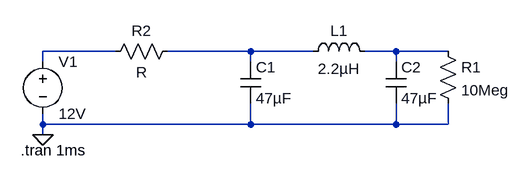
[diagram p0: schematic Draft1.asc]
Draft1.asc, the LTspice schematic file:
Version 4
SHEET 1 880 680
WIRE 0 128 -112 128
WIRE 208 128 80 128
WIRE 304 128 208 128
WIRE 432 128 384 128
WIRE 512 128 432 128
WIRE -112 144 -112 128
WIRE 208 144 208 128
WIRE 432 144 432 128
WIRE -112 240 -112 224
WIRE 208 240 208 208
WIRE 208 240 -112 240
WIRE 432 240 432 208
WIRE 432 240 208 240
WIRE 512 240 512 208
WIRE 512 240 432 240
WIRE -112 256 -112 240
FLAG -112 256 0
SYMBOL voltage -112 128 R0
WINDOW 123 0 0 Left 0
WINDOW 39 0 0 Left 0
SYMATTR InstName V1
SYMATTR Value 12V
SYMBOL cap 192 144 R0
SYMATTR InstName C1
SYMATTR Value 47µF
SYMBOL cap 416 144 R0
SYMATTR InstName C2
SYMATTR Value 47µF
SYMBOL ind 288 144 R270
WINDOW 0 32 56 VTop 2
WINDOW 3 5 56 VBottom 2
SYMATTR InstName L1
SYMATTR Value 2.2µH
SYMBOL res 496 112 R0
SYMATTR InstName R1
SYMATTR Value 10Meg
SYMBOL res 96 112 R90
WINDOW 0 0 56 VBottom 2
WINDOW 3 32 56 VTop 2
SYMATTR InstName R2
TEXT -146 280 Left 2 !.tran 1ms

The netlist it stands for:
* Draft1.asc
V1 N001 0 12V
C1 N002 0 47µF
C2 N003 0 47µF
L1 N002 N003 2.2µH
R1 N003 0 10Meg
R2 N002 N001 R
.tran 1ms
.backanno
.end